# EAGLE design MXC01.v1.1 (EAGLE 6.6.0)
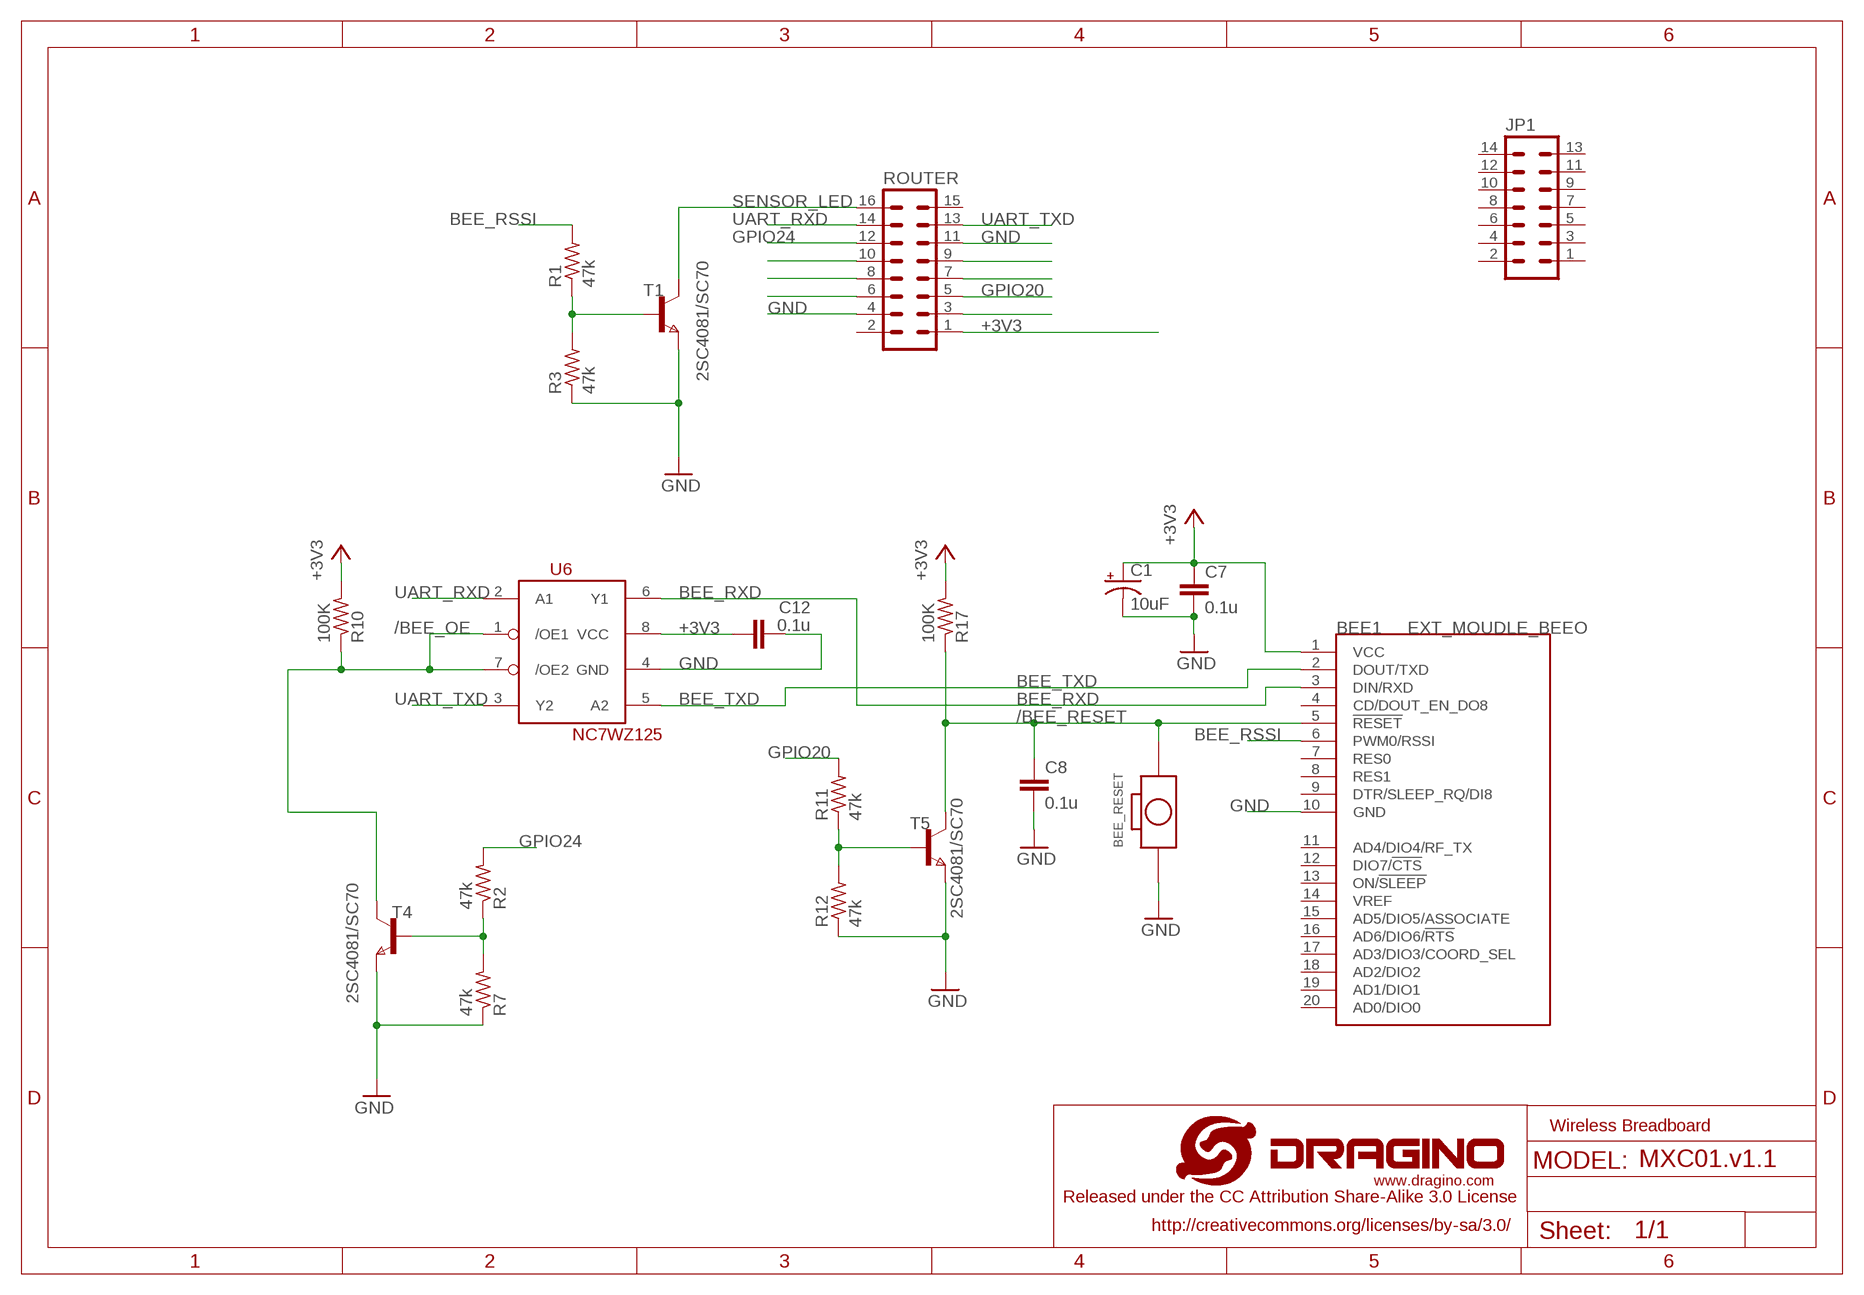
[diagram p0: schematic, sheet 1]

## Parts
BEE1  EXT_MOUDLE_BEEO  [EXT_MOUDLE_BEE]
BEE_RESET  CPT_SMD_BOTTON_1_SMD  [CPT_SMD_BOTTON_1]
C1  10uF  CPOL-USSMCA  [SMC_A]
C7  0.1u  C-EUC0402  [C0402]
C8  0.1u  C-EUC0402  [C0402]
C12  0.1u  C-EUC0402  [C0402]
JP1  MA07-2  [MA07-2]
R1  47k  R-US_R0402  [R0402]
R2  47k  R-US_R0402  [R0402]
R3  47k  R-US_R0402  [R0402]
R7  47k  R-US_R0402  [R0402]
R10  100K  R-US_R0402  [R0402]
R11  47k  R-US_R0402  [R0402]
R12  47k  R-US_R0402  [R0402]
R17  100K  R-US_R0402  [R0402]
ROUTER  MA08-2  [MA08-2]
T1  2SC4081/SC70  NPNSOT323  [SOT323]
T4  2SC4081/SC70  NPNSOT323  [SOT323]
T5  2SC4081/SC70  NPNSOT323  [SOT323]
U6  NC7WZ125  [US8]
U$1  LOGO-NEW  [LOGO-SILK-NEW]

## Nets
+3V3: BEE1.1(VCC) C1.+ C7.1 C12.1 R10.2 R17.2 ROUTER.1 U6.8(VCC)
/BEE_OE: R10.1 T4.1(C) U6.1(/OE1) U6.7(/OE2)
/BEE_RESET: BEE1.5(!RESET) BEE_RESET.P$2 C8.1 R17.1 T5.1(C)
BEE_RSSI: BEE1.6(PWM0/RSSI) R1.2
BEE_RXD: BEE1.3(DIN/RXD) U6.6(Y1)
BEE_TXD: BEE1.2(DOUT/TXD) U6.5(A2)
GND [gnd]: BEE1.10(GND) BEE_RESET.1 C1.- C7.2 C8.2 C12.2 R3.1 R7.1 R12.1 ROUTER.4 ROUTER.11 T1.3(E) T4.3(E) T5.3(E) U6.4(GND)
GPIO20: R11.2 ROUTER.5
GPIO24: R2.2 ROUTER.12
N$1: R1.1 R3.2 T1.2(B)
N$4: ROUTER.10
N$6: ROUTER.9
N$8: ROUTER.7
N$9: ROUTER.8
N$11: R2.1 R7.2 T4.2(B)
N$12: R11.1 R12.2 T5.2(B)
N$16: ROUTER.6
N$59: ROUTER.3
SENSOR_LED: ROUTER.16 T1.1(C)
UART_RXD: ROUTER.14 U6.2(A1)
UART_TXD: ROUTER.13 U6.3(Y2)
Unconnected: BEE1.4(CD/DOUT_EN_DO8) BEE1.7(RES0) BEE1.8(RES1) BEE1.9(DTR/SLEEP_RQ/DI8) BEE1.11(AD4/DIO4/RF_TX) BEE1.12(DIO7/!CTS) BEE1.13(ON/!SLEEP) BEE1.14(VREF) BEE1.15(AD5/DIO5/ASSOCIATE) BEE1.16(AD6/DIO6/!RTS) BEE1.17(AD3/DIO3/COORD_SEL) BEE1.18(AD2/DIO2) BEE1.19(AD1/DIO1) BEE1.20(AD0/DIO0) JP1.1 JP1.2 JP1.3 JP1.4 JP1.5 JP1.6 JP1.7 JP1.8 JP1.9 JP1.10 JP1.11 JP1.12 JP1.13 JP1.14 ROUTER.2 ROUTER.15

## Notes on the sheet
- Wireless Breadboard

## Library data of the parts
BEE1 = Bees_Shield:EXT_MOUDLE_BEE
BEE_RESET = Bees_Shield:CPT_SMD_BOTTON_1
C1 = rcl:CPOL-US: POLARIZED CAPACITOR, American symbol
C7 C8 C12 = dragino:C-EU: CAPACITOR, European symbol
JP1 = dragino:MA07-2: PIN HEADER; OC_FARNELL: unknown; OC_NEWARK: unknown
R1-R3 R7 R10-R12 R17 = dragino:R-US_: RESISTOR, American symbol
ROUTER = dragino:MA08-2: PIN HEADER; OC_FARNELL: unknown; OC_NEWARK: unknown
T1 T4 T5 = zetex:NPNSOT323: NPN TRANSISTOR; MPN: DSS4160U-7; OC_FARNELL: 1710696; OC_NEWARK: 25R4558
U6 = dragino:NC7WZ125: 3 state buffer: http://www.fairchildsemi.com/ds/NC/NC7WZ125.pdf
U$1 = dragino:LOGO-NEW

## Net classes
0 default: width 0.203 mm, clearance 0.254 mm
1 power: width 0.61 mm, drill 0.61 mm, clearance 0.254 mm
2 gnd: width 0.305 mm, drill 0.33 mm, clearance 0.254 mm
3 usbvcc: width 0.508 mm, drill 0.61 mm, clearance 0.254 mm
4 aref: width 0.406 mm, drill 0.61 mm, clearance 0.254 mm
5 usbtrace: width 0.254 mm, clearance 0.152 mm

## Board
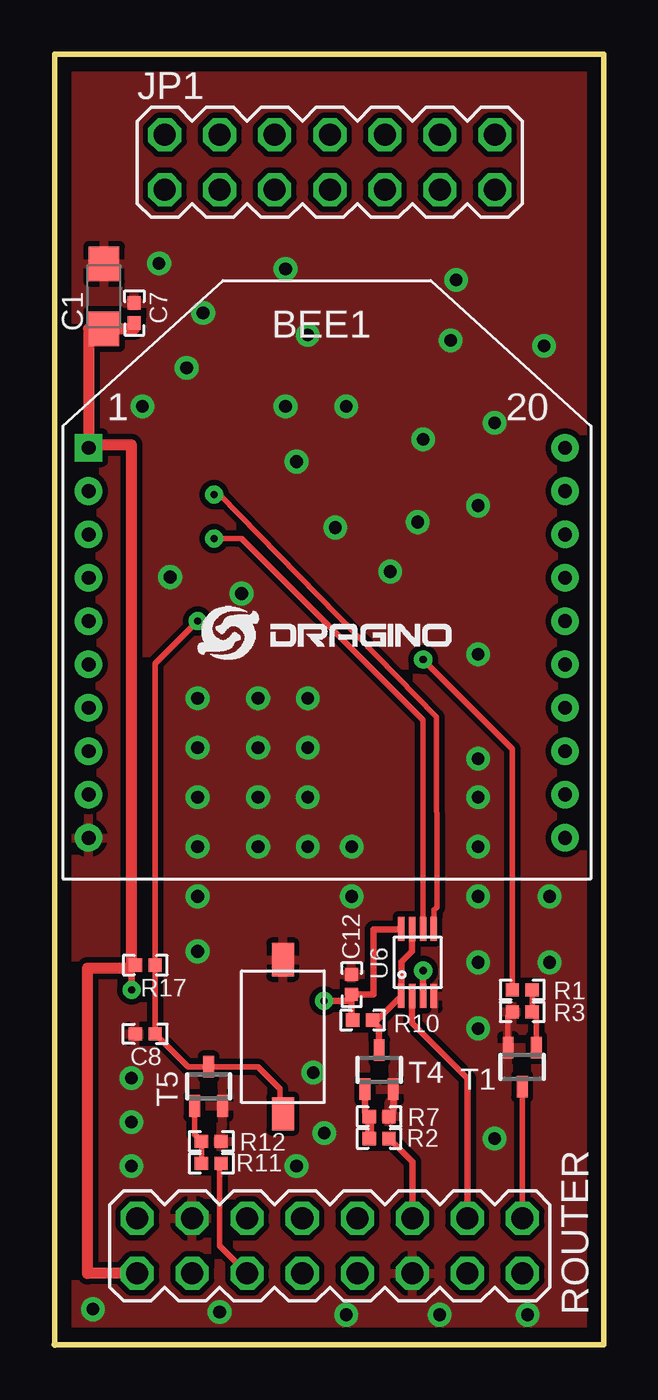
[diagram p1: board, top side]
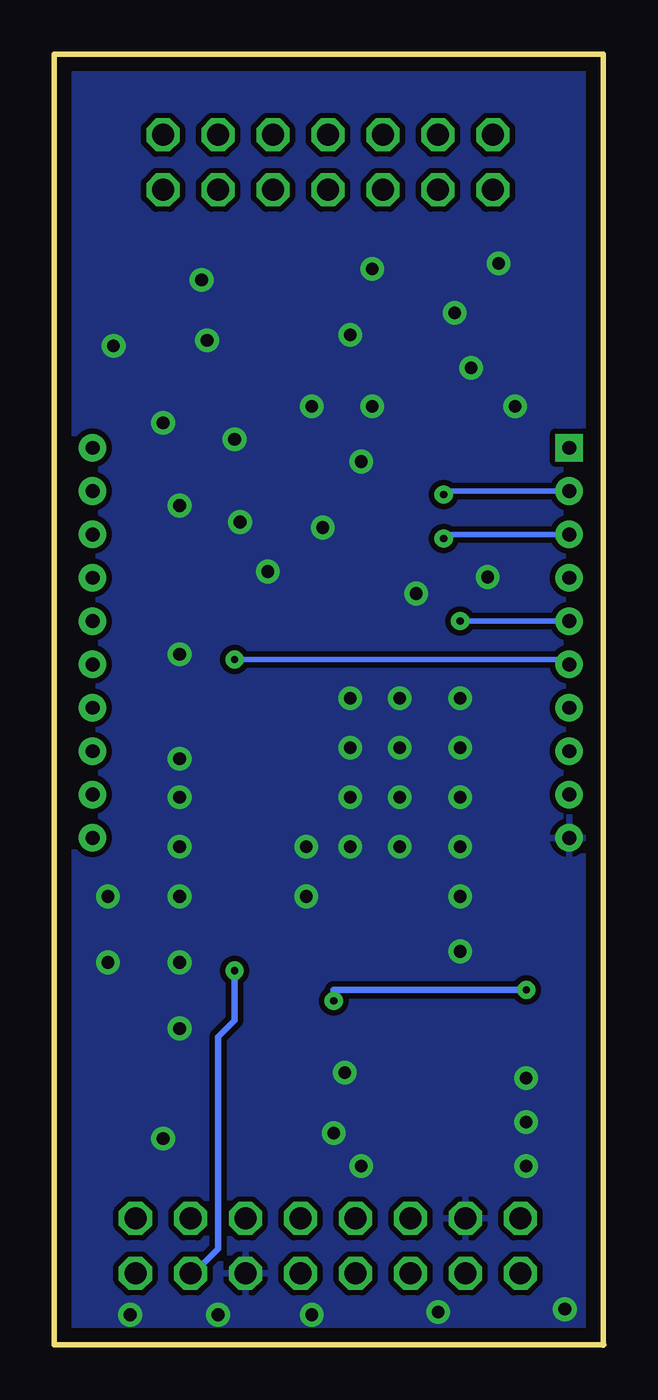
[diagram p2: board, bottom side, seen from below]

Size 25.37 x 59.58 mm. Coordinates in mm from the lower left corner, seen from the top.
Outline: 0,0.02 25.37,0.02 25.37,59.58 0.02,59.58 0.02,0
Copper layers (1*16): Top 0.035mm / dielectric 1.5mm / Bottom 0.035mm
Design rules "default": minimum track width 5mil, minimum drill 10mil, track to track 6mil, track to pad 7mil, pad to pad 7mil, via to via 10mil, smd to smd 7mil, copper to edge 26mil, drill to drill 10mil, minimum pad ring 10mil, minimum via ring 10mil, stop-mask expansion 1mil, vias tented up to drill 30mil, thermal gap 10mil

### Footprints (pad centres in the part's own frame; a part is rotated, then mirrored left to right if it is on the bottom)
EXT_MOUDLE_BEE = drill 0.635 pad 1.27 square: 1 -11,0 | drill 0.635 pad 1.27: 2 -11,-2; 3 -11,-4; 4 -11,-6; 5 -11,-8; 6 -11,-10; 7 -11,-12; 8 -11,-14; 9 -11,-16; 10 -11,-18; 11 11,-18; 12 11,-16; 13 11,-14; 14 11,-12; 15 11,-10; 16 11,-8; 17 11,-6; 18 11,-4; 19 11,-2; 20 11,0
CPT_SMD_BOTTON_1 = smd 1.524 x 1.016: 1 -3.556,0; P$2 3.556,0
SMC_A = smd 1.6 x 1.4: + -1.5,0; - 1.5,0
C0402 = smd 0.61 x 0.61: 1 -0.457,0; 2 0.457,0
MA07-2 = drill 1.016 octagon: 1 -7.62,-1.27; 2 -7.62,1.27; 3 -5.08,-1.27; 4 -5.08,1.27; 5 -2.54,-1.27; 6 -2.54,1.27; 7 0,-1.27; 8 0,1.27; 9 2.54,-1.27; 10 2.54,1.27; 11 5.08,-1.27; 12 5.08,1.27; 13 7.62,-1.27; 14 7.62,1.27
R0402 = smd 0.61 x 0.61: 1 -0.457,0; 2 0.457,0
MA08-2 = drill 1.016 octagon: 1 -8.89,-1.27; 2 -8.89,1.27; 3 -6.35,-1.27; 4 -6.35,1.27; 5 -3.81,-1.27; 6 -3.81,1.27; 7 -1.27,-1.27; 8 -1.27,1.27; 9 1.27,-1.27; 10 1.27,1.27; 11 3.81,-1.27; 12 3.81,1.27; 13 6.35,-1.27; 14 6.35,1.27; 15 8.89,-1.27; 16 8.89,1.27
SOT323 = smd 0.5 x 1: 1 0,0.9; 2 -0.65,-0.9; 3 0.65,-0.9
US8 = smd 0.3 x 1.1: 1 -0.75,-1.55; 2 -0.25,-1.55; 3 0.25,-1.55; 4 0.75,-1.55; 5 0.75,1.55; 6 0.25,1.55; 7 -0.25,1.55; 8 -0.75,1.55

### Placement (x,y rotation side)
BEE1  12.59,41.42 0 top
BEE_RESET  10.56,14.24 270 top
C1  2.3,48.4 90 top
C7  3.7,47.64 90 top
C8  4.21,14.37 180 top
C12  13.73,16.65 90 top
JP1  12.72,54.59 0 top
R1  21.61,16.4 180 top
R2  15,9.54 0 top
R3  21.61,15.38 0 top
R7  15,10.56 180 top
R10  14.24,15 180 top
R11  7.26,8.4 0 top
R12  7.26,9.41 180 top
R17  4.21,17.54 180 top
ROUTER  12.72,4.59 0 top
T1  21.61,12.84 180 top
T4  15,12.72 0 top
T5  7.13,11.95 0 top
U6  16.78,17.67 0 top
U$1  6.62,31.64 0 top

### Tracks (layer width: path | path; a pad name or v marks a point on that pad's centre or on a via)
+3V3  (via drill 0.33)
  Top 0.305: C12.1 13.73,15.05 R10.2 | R17.2 3.57,17.54 3.57,17.41 v3.57,16.4 | v12.46,15.89 13.73,15.89 C12.1 | C12.1 14.75,16.2 14.75,19.19 16.03,19.19 U6.8
  Top 0.508: ROUTER.1 1.54,3.32 1.54,17.41 3.57,17.41 3.57,41.55 1.59,41.55 BEE1.1 1.59,46.9 C1.+ 3.7,46.9 C7.1
  Bottom 0.305: v3.57,16.4 12.46,16.4 v12.46,15.89
/BEE_OE
  Top 0.305: T4.1 15,14.7 R10.1 14.91,15 U6.1 16.03,17.68 16.53,18.18 U6.7
/BEE_RESET  (via drill 0.33)
  Top 0.254: v6.62,33.42 4.66,31.46 R17.1 C8.1 6.18,12.85 T5.1 9.4,12.85 10.43,11.83 10.43,10.81 BEE_RESET.P$2
  Bottom 0.254: v6.62,33.42 BEE1.5
BEE_RSSI  (via drill 0.33)
  Top 0.254: R1.2 21.15,27.52 v17.03,31.64
  Bottom 0.254: v17.03,31.64 1.81,31.64 BEE1.6
BEE_RXD  (via drill 0.33)
  Top 0.254: U6.6 17.03,28.85 8.65,37.23 v7.38,37.23
  Bottom 0.254: v7.38,37.23 7.19,37.42 BEE1.3
BEE_TXD  (via drill 0.33)
  Top 0.254: U6.5 17.54,19.22 17.54,20.08 17.67,20.21 17.66,28.98 7.64,39.26 v7.38,39.26
  Bottom 0.254: v7.38,39.26 7.22,39.42 BEE1.2
GND  (via drill 0.58)
  Top 0.254: R3.1 20.96,15.19 T1.3
  Top 0.305: T4.3 15.65,10.75 R7.1
  other vias: 3.57,8.27 1.79,1.67 7.64,1.54 13.48,1.41 17.8,1.41 21.86,1.41 3.57,10.3 3.57,12.34 11.19,8.27 12.46,9.8 11.95,12.59 20.34,9.54 19.57,14.62 19.57,17.67 13.73,20.72 13.73,23 6.62,18.18 19.57,20.72 19.57,23 19.57,25.29 19.57,27.07 22.88,17.67 22.88,20.72 6.62,20.72 6.62,23 6.62,25.29 6.62,27.57 6.62,29.86 9.41,27.57 9.41,25.29 9.41,23 11.7,23 11.7,25.29 11.7,27.57 9.41,29.86 11.7,29.86 19.57,31.89 5.35,35.45 8.65,34.69 4.84,49.93 6.87,47.64 6.11,45.1 4.08,43.32 10.68,43.32 11.7,46.62 10.68,49.67 18.56,49.16 18.3,46.37 17.03,41.8 22.62,46.12 16.78,37.99 12.97,37.73 11.19,40.78 13.48,43.32 19.57,38.75 20.34,42.56 15.51,35.7
  pour Top (rank 2): -3.03,62.79 28.59,62.66 28.59,8.51 28.46,0.02 -3.03,0.14
  pour Bottom (rank 2): -3.03,-0.11 28.46,0.14 28.59,8.81 28.59,62.75 -3.03,63.13
GPIO20
  Top 0.254: ROUTER.5 7.64,4.6 7.64,8.32 R11.2
GPIO24
  Top 0.305: ROUTER.12 16.53,8.47 R2.2
N$1
  Top 0.254: T1.2 22.26,15.19 R3.2 R1.1
N$11
  Top 0.305: R7.2 14.35,10.75 T4.2
  Top 0.406: R7.2 R2.1
N$12
  Top 0.254: T5.2 6.48,9.73 R12.2 R11.1
SENSOR_LED
  Top 0.254: ROUTER.16 T1.1
UART_RXD
  Top 0.305: ROUTER.14 19.07,12.33 16.53,14.88 U6.2
UART_TXD  (via drill 0.33)
  Top 0.305: v17.03,17.29 U6.3
  Bottom 0.305: ROUTER.13 18.94,3.32 17.8,4.46 17.8,14.24 17.03,15 v17.03,17.29

### Text on the board
tDocu: BEE SOCKET | Model: MXC01 v1.1 | Bee Coverter
214bmp: D:/SmartProjects/Snc/a4_bn_logo2.bmp